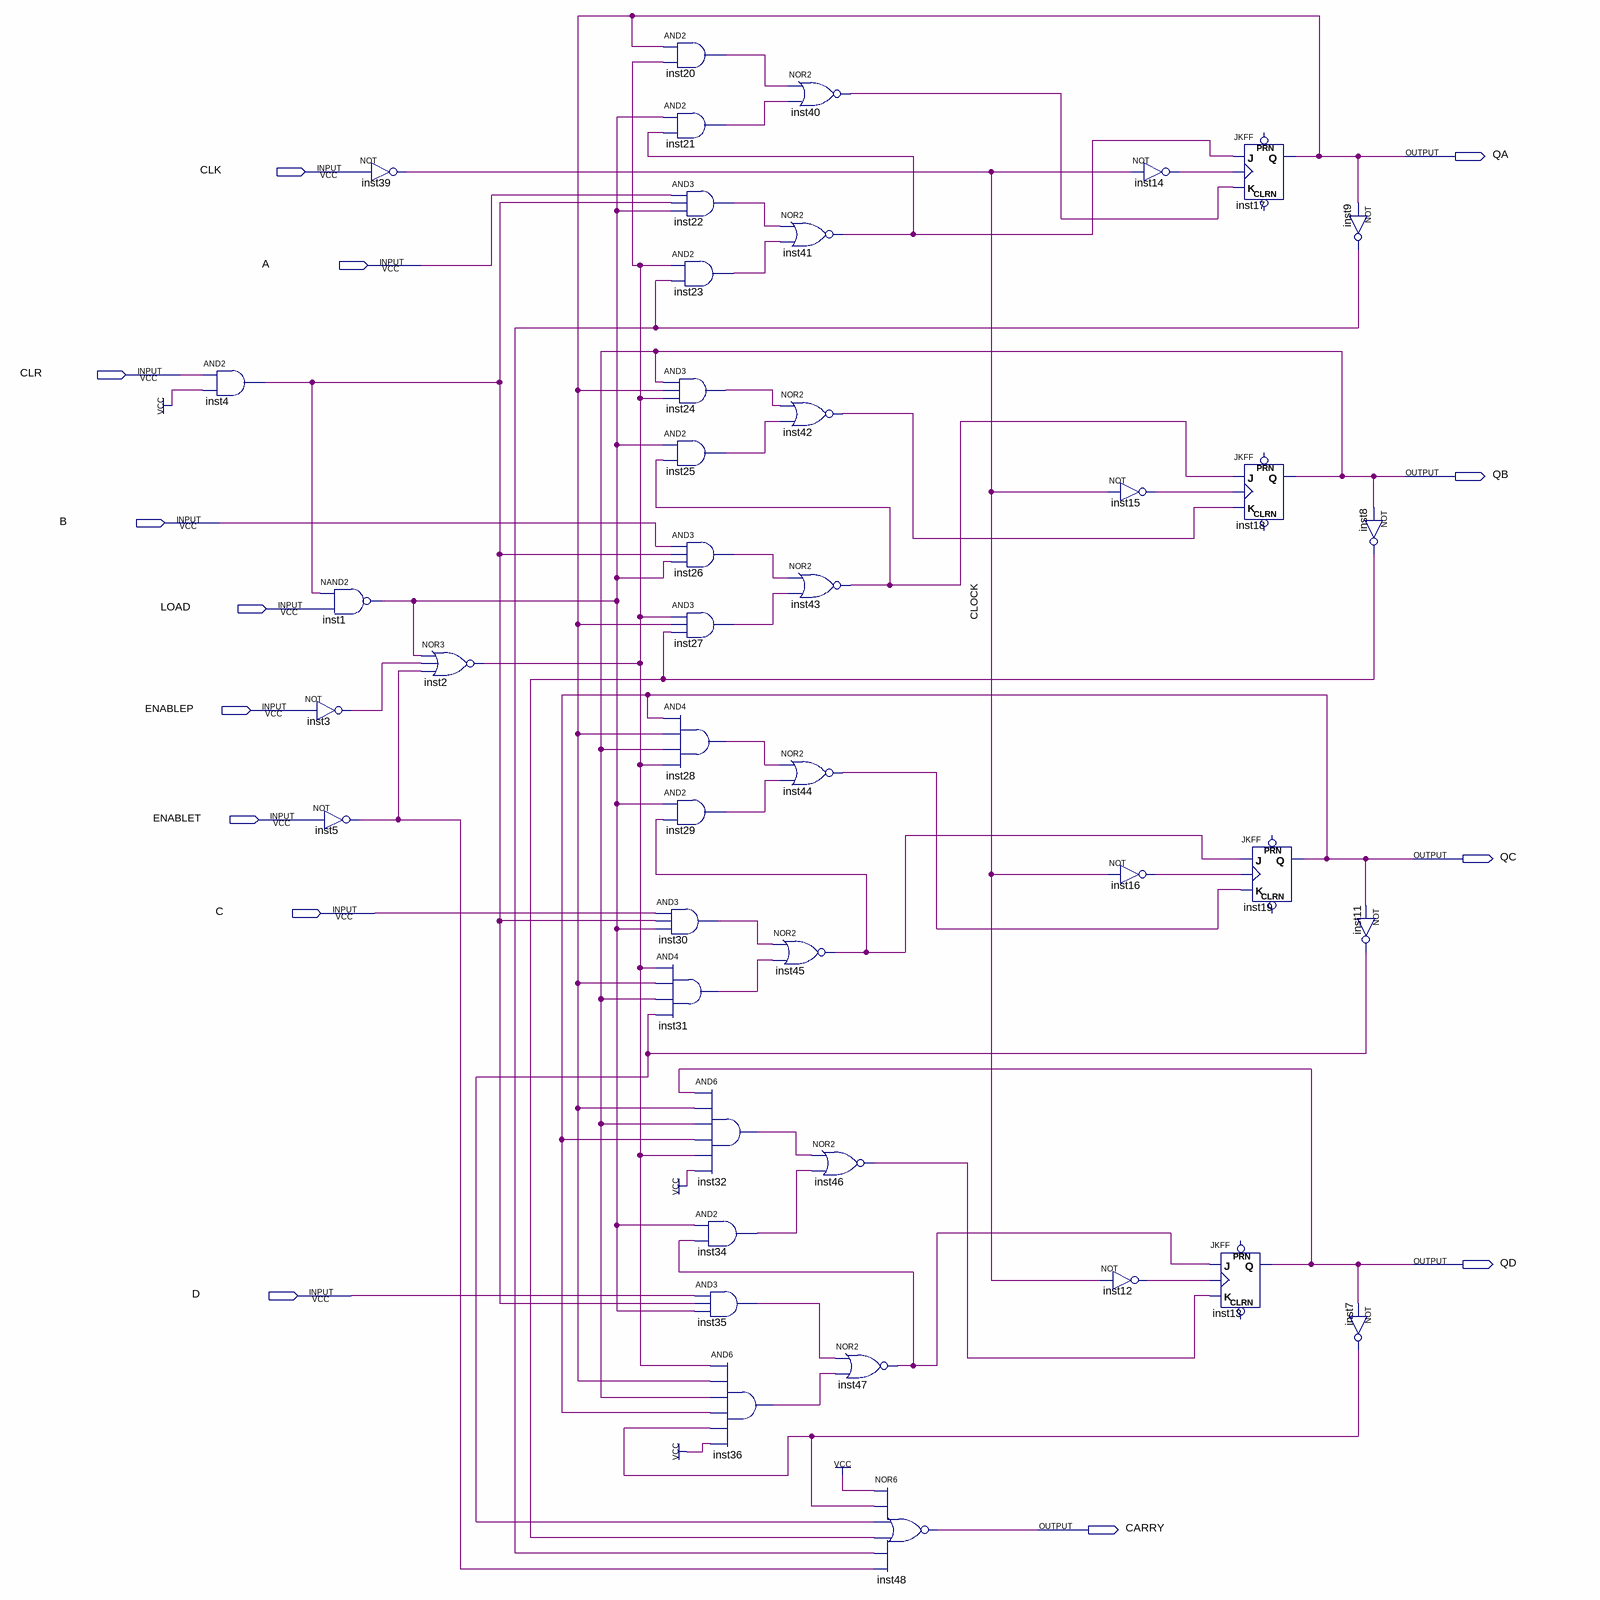
[diagram p0: schematic sheet]
// Quartus schematic ALP74LS161.bdf as structural Verilog: 43 symbols, 14 pins
module ALP74LS161 (
  input  CLK,
  input  A,
  input  CLR,
  input  B,
  input  LOAD,
  input  ENABLEP,
  input  ENABLET,
  input  C,
  input  D,
  output QA,
  output QB,
  output QC,
  output QD,
  output CARRY
);

  wire CLOCK, inst1_out, inst2_out, inst3_out, inst4_out, inst5_out, inst7_out, inst8_out, inst9_out,
       inst11_out, inst12_out, inst14_out, inst15_out, inst16_out, inst20_out, inst21_out, inst22_out,
       inst23_out, inst24_out, inst25_out, inst26_out, inst27_out, inst28_out, inst29_out, inst30_out,
       inst31_out, inst32_out, inst34_out, inst35_out, inst36_out, inst40_out, inst41_out, inst42_out,
       inst43_out, inst44_out, inst45_out, inst46_out, inst47_out;

  and inst4 (inst4_out, CLR, 1'b1);
  not inst39 (CLOCK, CLK);
  nand inst1 (inst1_out, inst4_out, LOAD);
  not inst3 (inst3_out, ENABLEP);
  not inst5 (inst5_out, ENABLET);
  nor inst2 (inst2_out, inst1_out, inst3_out, inst5_out);
  and inst20 (inst20_out, QA, inst2_out);
  and inst21 (inst21_out, inst1_out, inst41_out);
  and inst22 (inst22_out, A, inst4_out, inst1_out);
  and inst23 (inst23_out, inst2_out, inst9_out);
  and inst24 (inst24_out, QB, QA, inst2_out);
  and inst25 (inst25_out, inst1_out, inst43_out);
  and inst26 (inst26_out, B, inst4_out, inst1_out);
  and inst27 (inst27_out, inst2_out, QA, inst8_out);
  and inst28 (inst28_out, QC, QA, QB, inst2_out);
  and inst29 (inst29_out, inst1_out, inst45_out);
  and inst30 (inst30_out, C, inst4_out, inst1_out);
  and inst31 (inst31_out, inst2_out, QA, QB, inst11_out);
  and inst32 (inst32_out, QD, QA, QB, QC, inst2_out, 1'b1);
  and inst34 (inst34_out, inst1_out, inst47_out);
  and inst35 (inst35_out, D, inst4_out, inst1_out);
  and inst36 (inst36_out, inst2_out, QA, QB, QC, inst7_out, 1'b1);
  nor inst40 (inst40_out, inst20_out, inst21_out);
  nor inst41 (inst41_out, inst22_out, inst23_out);
  nor inst42 (inst42_out, inst24_out, inst25_out);
  nor inst43 (inst43_out, inst26_out, inst27_out);
  nor inst44 (inst44_out, inst28_out, inst29_out);
  nor inst45 (inst45_out, inst30_out, inst31_out);
  nor inst46 (inst46_out, inst32_out, inst34_out);
  nor inst47 (inst47_out, inst35_out, inst36_out);
  nor inst48 (CARRY, 1'b1, inst7_out, inst11_out, inst8_out, inst9_out, inst5_out);
  not inst15 (inst15_out, CLOCK);
  not inst16 (inst16_out, CLOCK);
  not inst12 (inst12_out, CLOCK);
  not inst14 (inst14_out, CLOCK);
  JKFF inst17 (.K(inst40_out), .J(inst41_out), .CLK(inst14_out), .Q(QA));  // open: PRN, CLRN
  JKFF inst18 (.K(inst42_out), .J(inst43_out), .CLK(inst15_out), .Q(QB));  // open: PRN, CLRN
  JKFF inst13 (.K(inst46_out), .J(inst47_out), .CLK(inst12_out), .Q(QD));  // open: PRN, CLRN
  JKFF inst19 (.K(inst44_out), .J(inst45_out), .CLK(inst16_out), .Q(QC));  // open: PRN, CLRN
  not inst9 (inst9_out, QA);
  not inst8 (inst8_out, QB);
  not inst11 (inst11_out, QC);
  not inst7 (inst7_out, QD);
endmodule
